# Altium schematic sheet 华怡丰LS201-T10MND 2022款手抄原理图.SchDoc
size A3
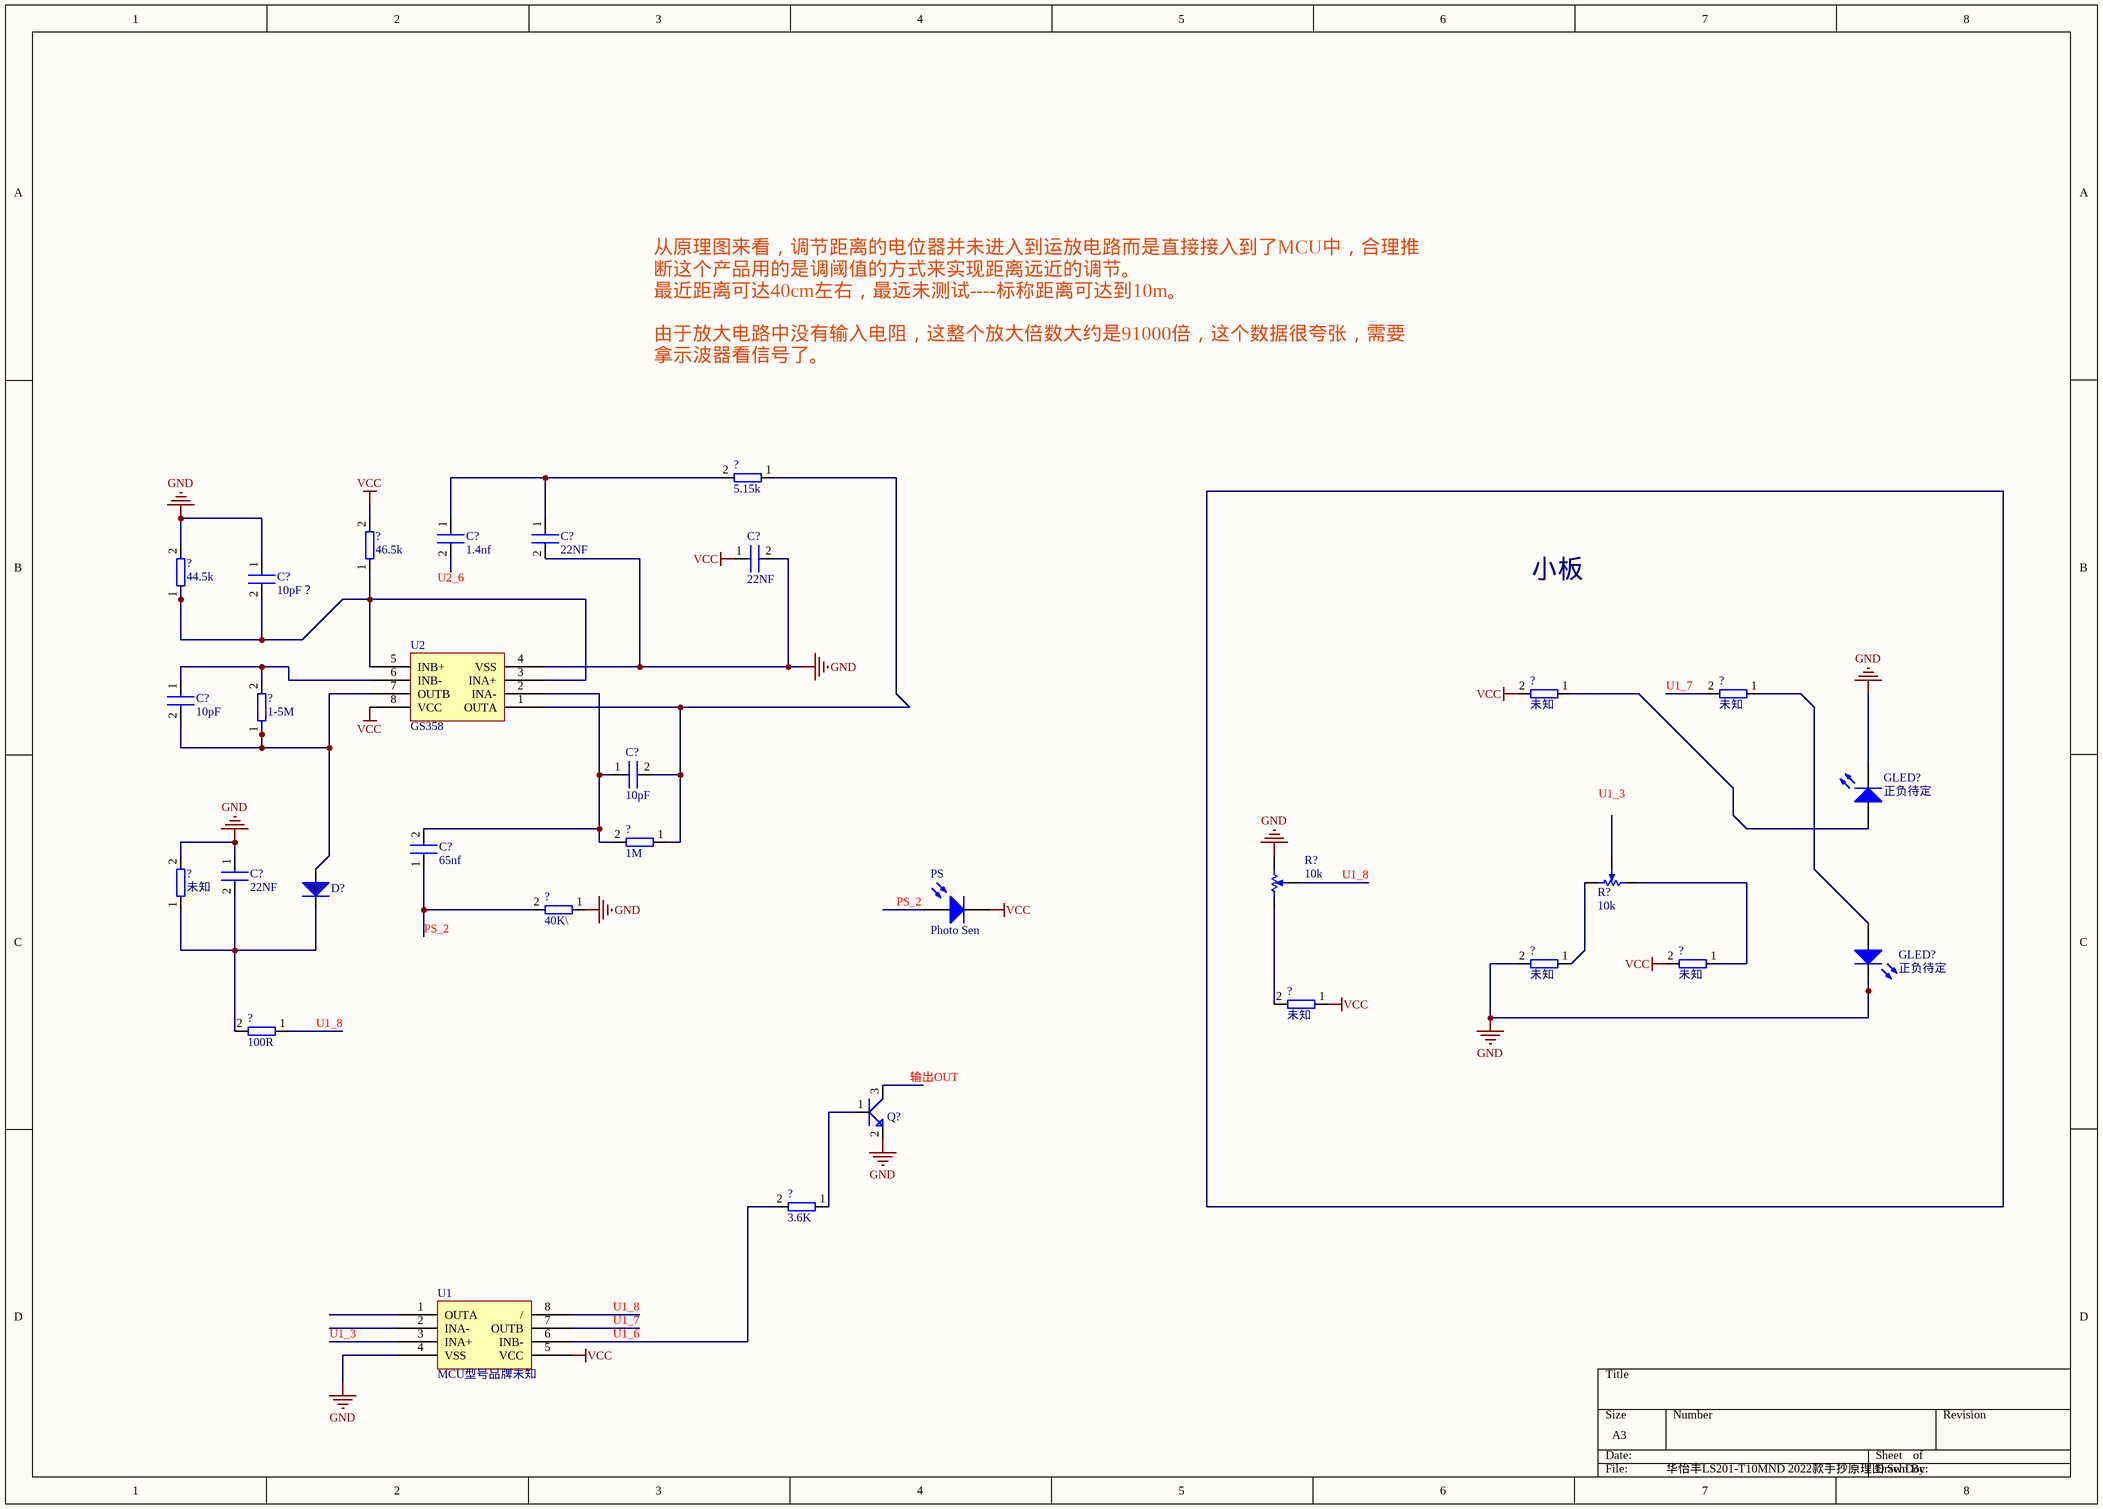
[diagram p0: 华怡丰LS201-T10MND 2022款手抄原理图.SchDoc]

## Parts
(Parts that share a designator on the sheet are numbered #1, #2 ... from top to bottom, then left to right.)
?#1  5.15k
?#2  46.5k
?#3  44.5k
?#4  未知
?#5  未知
?#6  1-5M
?#7  1M
?#8  未知
?#9  40K\
?#10  未知
?#11  未知
?#12  未知
?#13  100R
?#14  3.6K
C?#1  1.4nf
C?#2  22NF
C?#3  22NF
C?#4  10pF？
C?#5  10pF
C?#6  10pF
C?#7  22NF
C?#8  65nf
D?  (no value)
GLED?#1  正负待定  [LED-0]
GLED?#2  正负待定  [LED-0]
PS  Photo Sen  [PIN2]
Q?  2SC4617TLR  (value not drawn)
R?#1  10k  [POT4MM-2]
R?#2  10k  [POT4MM-2]
U1  MCU型号品牌未知
U2  GS358

## Nets
GND: ?#3.2 ?#8.2 ?#9.1 ?#10.2 C?#2.2 C?#3.2 C?#4.1 C?#7.1 GLED?#1.2(K) GLED?#2.2(K) Q?.2(E) R?#1.CW(+) U1.4(VSS) U2.4(VSS)
VCC: ?#2.2 ?#4.2 ?#11.2 ?#12.1 C?#3.1 PS.2(K) U1.5(VCC) U2.8(VCC)
Net?#1_1: ?#1.1 ?#7.1 C?#6.2 U2.1(OUTA)
Net?#1_2: ?#1.2 C?#1.1 C?#2.1
Net?#2_1: ?#2.1 ?#3.1 C?#4.2 U2.3(INA+) U2.5(INB+)
Net?#4_1: ?#4.1 GLED?#1.1(A)
Net?#5_1: ?#5.1 GLED?#2.1(A)
Net?#6_1: ?#6.1 C?#5.2 D?.1 U2.7(OUTB)
Net?#6_2: ?#6.2 C?#5.1 U2.6(INB-)
Net?#7_2: ?#7.2 C?#6.1 C?#8.2 U2.2(INA-)
Net?#8_1: ?#8.1 ?#13.2 C?#7.2 D?.2
Net?#9_2: ?#9.2 C?#8.1
Net?#10_1: ?#10.1 R?#2.CW(+)
Net?#11_1: ?#11.1 R?#2.CCW(-)
Net?#12_2: ?#12.2 R?#1.CCW(-)
Net?#14_1: ?#14.1 Q?.1(B)
Net?#14_2: ?#14.2 U1.6(INB-)

Not connected (* = marked no-connect by the designer): ?#5 2; ?#13 1; C?#1 2; PS 1(A); Q? 3(C); R?#1 W; R?#2 W; U1 1(OUTA) 2(INA-) 3(INA+) 7(OUTB) 8(/)

## Notes on the sheet
- 从原理图来看，调节距离的电位器并未进入到运放电路而是直接接入到了MCU中，合理推断这个产品用的是调阈值的方式来实现距离远近的调节。
  最近距离可达40cm左右，最远未测试----标称距离可达到10m。
  由于放大电路中没有输入电阻，这整个放大倍数大约是91000倍，这个数据很夸张，需要拿示波器看信号了。
- (near C?#1) U2_6
- 小板
- (near ?#5) U1_7
- U1_3
- (near PS) PS_2
- U1_8
- PS_2
- (near ?#13) U1_8
- (near Q?) 输出OUT
- U1_7
- U1_6

## Library data of the parts
?#1-?#14 = RES
C?#1-C?#8 = CAP
D? = D
GLED?#1 GLED?#2 = LED0: Typical INFRARED GaAs LED; Published: 8-Jun-2000; LatestRevisionDate: 08-Jul-2005; LatestRevisionNote: Mech Layer 1 removed.; PackageReference: LED-0; Publisher: Altium Limited; PackageDescription: LED; 2 Leads
PS = Photo Sen: Photosensitive Diode; Published: 24-Mar-1999; LatestRevisionDate: 17-Jul-2002; LatestRevisionNote: Re-released for DXP Platform.; PackageReference: PIN2; Publisher: Altium Limited
Q? = 2SC4617
R?#1 R?#2 = RPot SM: Square Trimming Potentiometer; Published: 17-Dec-2003; DatasheetVersion: Oct-2003; PackageReference: POT4MM-2; Publisher: Altium Limited; PackageDescription: Square Trimming Potentiometer; ComponentLink1Description: Manufacturer Link; ComponentLink1URL: http://bourns.com/2/search.html
U1 = GS358